# EAGLE design AntiAlias Filter_Diff_Active (EAGLE 9.5.2)

## Sheet 1 of 2
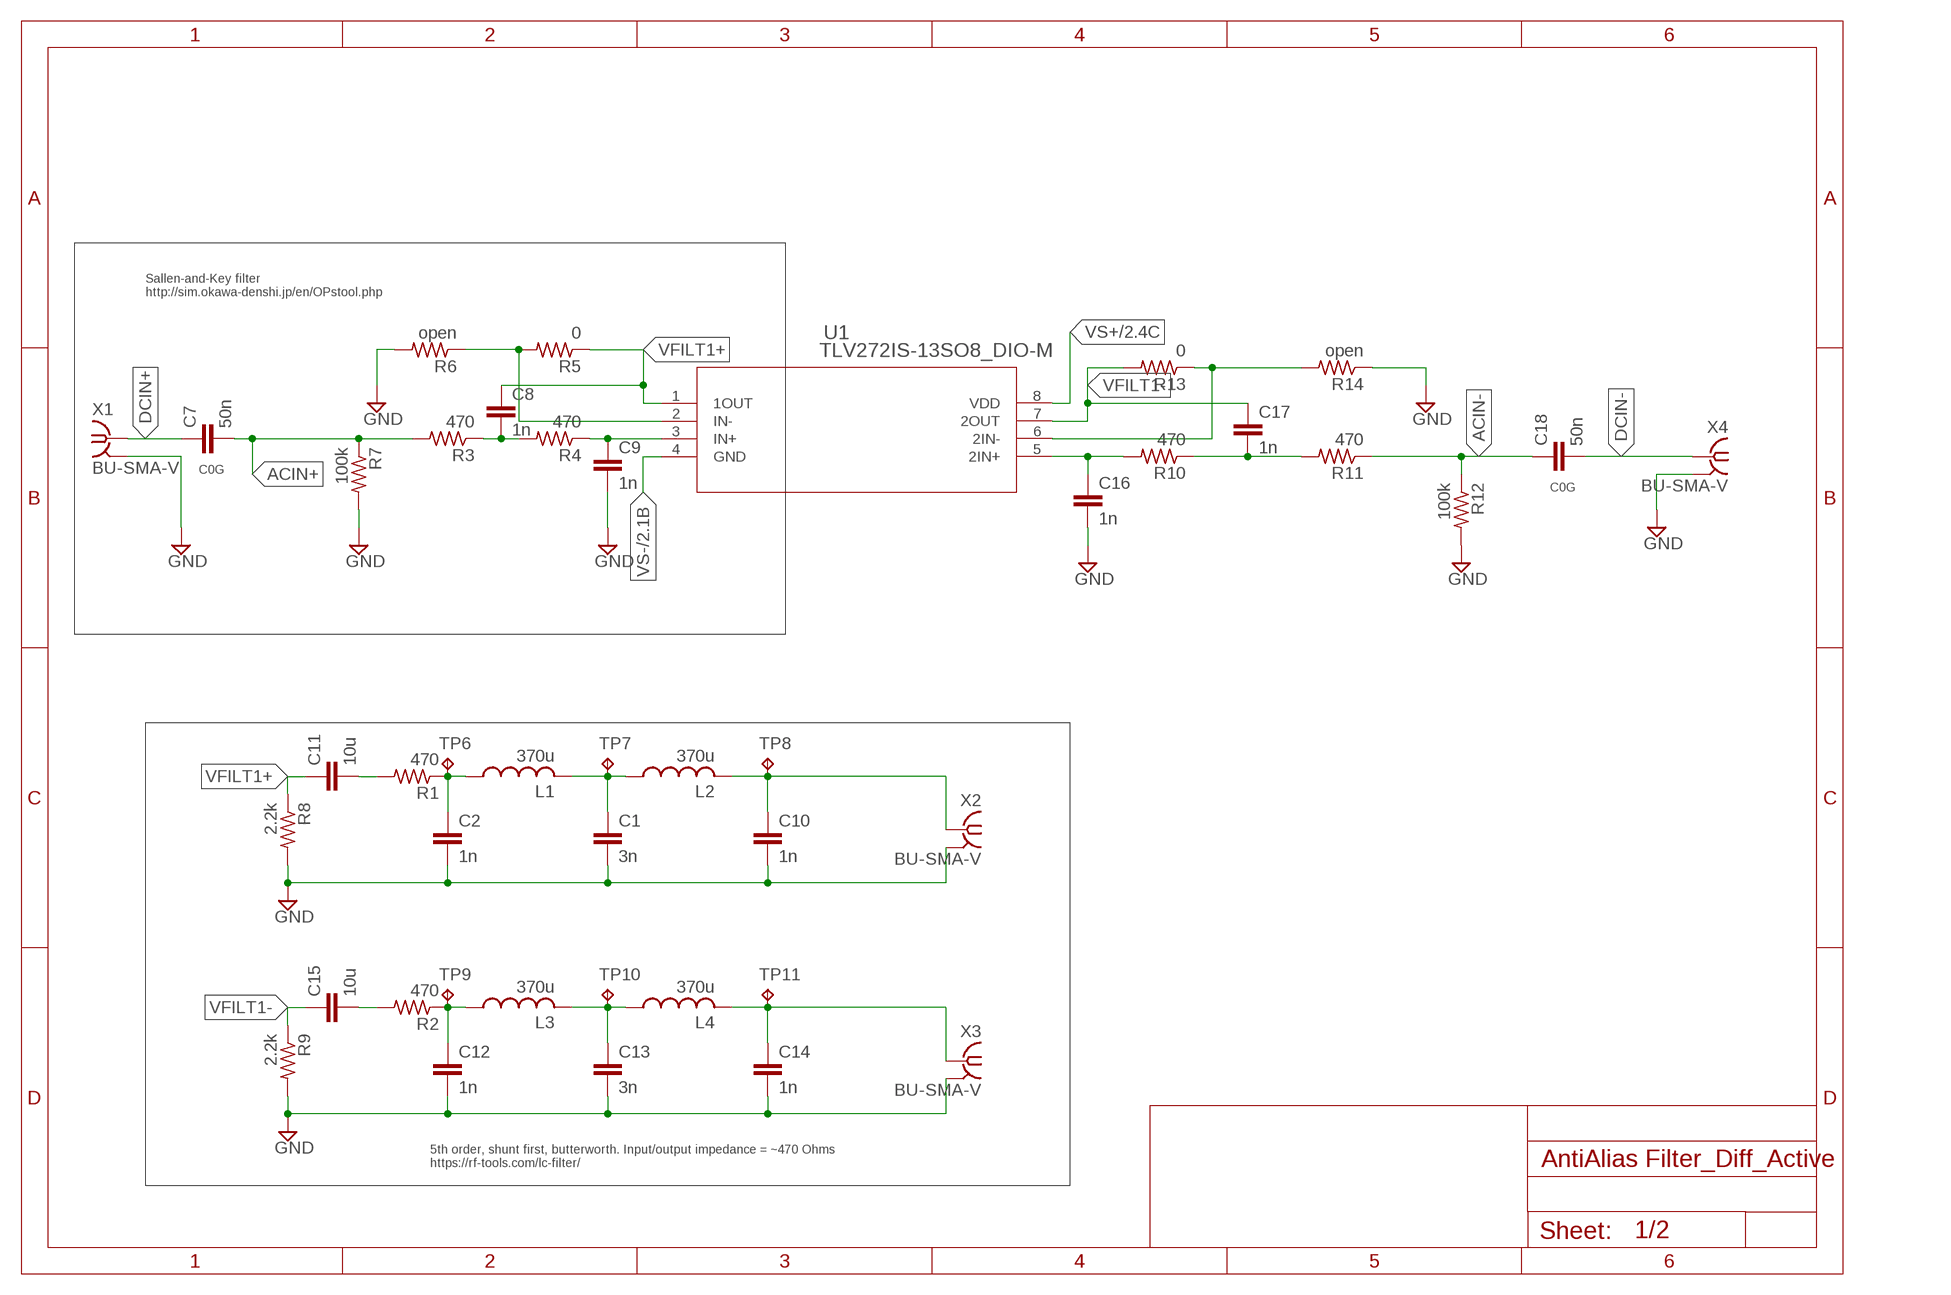
[diagram p0: schematic, sheet 1]

### Parts
C1  3n  C-EUC1206  [C1206]
C2  1n  C-EUC1206  [C1206]
C7  50n  C-EUC1210  [C1210]
C8  1n  C-EUC1206  [C1206]
C9  1n  C-EUC1206  [C1206]
C10  1n  C-EUC1206  [C1206]
C11  10u  C-EUC1210  [C1210]
C12  1n  C-EUC1206  [C1206]
C13  3n  C-EUC1206  [C1206]
C14  1n  C-EUC1206  [C1206]
C15  10u  C-EUC1210  [C1210]
C16  1n  C-EUC1206  [C1206]
C17  1n  C-EUC1206  [C1206]
C18  50n  C-EUC1210  [C1210]
L1  370u  L-USL1812  [L1812]
L2  370u  L-USL1812  [L1812]
L3  370u  L-USL1812  [L1812]
L4  370u  L-USL1812  [L1812]
R1  470  R-US_R1206  [R1206]
R2  470  R-US_R1206  [R1206]
R3  470  R-US_R1206  [R1206]
R4  470  R-US_R1206  [R1206]
R5  0  R-US_R1206  [R1206]
R6  open  R-US_R1206  [R1206]
R7  100k  R-US_R1206  [R1206]
R8  2.2k  R-US_R1206  [R1206]
R9  2.2k  R-US_R1206  [R1206]
R10  470  R-US_R1206  [R1206]
R11  470  R-US_R1206  [R1206]
R12  100k  R-US_R1206  [R1206]
R13  0  R-US_R1206  [R1206]
R14  open  R-US_R1206  [R1206]
TP6  TPTP20SQ  [TP20SQ]
TP7  TPTP20SQ  [TP20SQ]
TP8  TPTP20SQ  [TP20SQ]
TP9  TPTP20SQ  [TP20SQ]
TP10  TPTP20SQ  [TP20SQ]
TP11  TPTP20SQ  [TP20SQ]
U1  TLV272IS-13SO8_DIO-M  [SO8_DIO-M]
X1  BU-SMA-V  [BU-SMA-V]
X2  BU-SMA-V  [BU-SMA-V]
X3  BU-SMA-V  [BU-SMA-V]
X4  BU-SMA-V  [BU-SMA-V]

### Nets
ACIN+: C7.2 R3.2 R7.1
ACIN-: C18.1 R11.1 R12.1
DCIN+: C7.1 X1.1
DCIN-: C18.2 X4.1
GND [Power]: C1.2 C2.2 C9.2 C10.2 C12.2 C13.2 C14.2 C16.2 R6.2 R7.2 R8.2 R9.2 R12.2 R14.1 X1.2 X1.3 X1.4 X1.5 X2.2 X2.3 X2.4 X2.5 X3.2 X3.3 X3.4 X3.5 X4.2 X4.3 X4.4 X4.5 ; also sheet 2
N$1: C2.1 L1.1 R1.1 TP6.TP
N$2: C1.1 L1.2 L2.1 TP7.TP
N$3: C11.2 R1.2
N$4: C10.1 L2.2 TP8.TP X2.1
N$7: C14.1 L4.2 TP11.TP X3.1
N$8: C9.1 R4.1 U1.3(IN+)
N$9: C8.2 R3.1 R4.2
N$10: R5.2 R6.1 U1.2(IN-)
N$11: C12.1 L3.1 R2.1 TP9.TP
N$12: C13.1 L3.2 L4.1 TP10.TP
N$13: C15.2 R2.2
N$16: C17.2 R10.1 R11.2
N$17: C16.1 R10.2 U1.5(2IN+)
N$19: R13.1 R14.2 U1.6(2IN-)
VFILT1+: C8.1 C11.1 R5.1 R8.1 U1.1(1OUT)
VFILT1-: C15.1 C17.1 R9.1 R13.2 U1.7(2OUT)
VS+ [Power]: U1.8(VDD) ; also sheet 2
VS- [Power]: U1.4(GND) ; also sheet 2

### Notes on the sheet
- Sallen-and-Key filter
  http://sim.okawa-denshi.jp/en/OPstool.php
- C0G
- C0G
- 5th order, shunt first, butterworth. Input/output impedance = ~470 Ohms
  https://rf-tools.com/lc-filter/

## Sheet 2 of 2
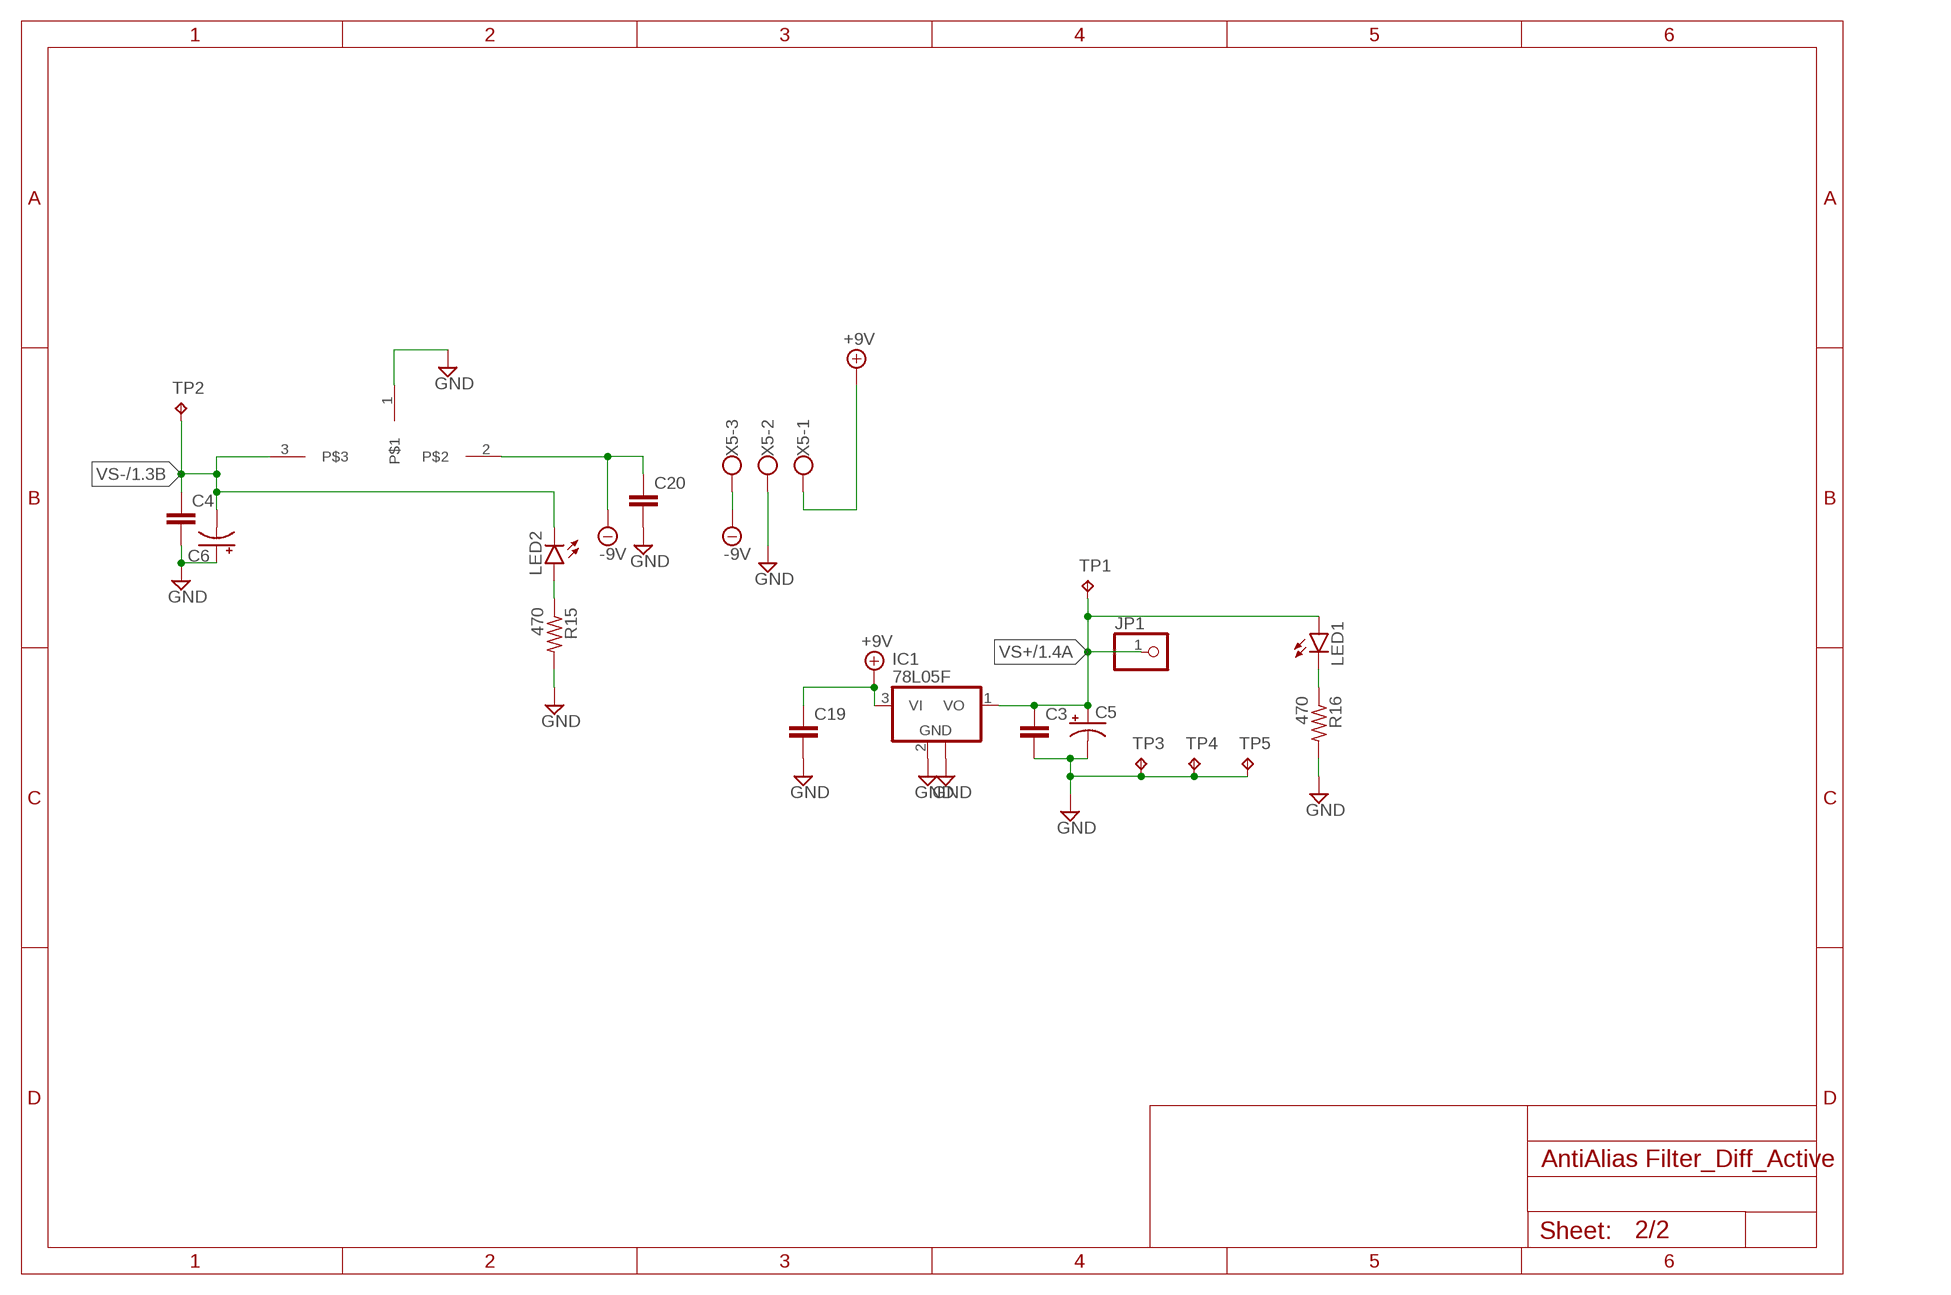
[diagram p1: schematic, sheet 2]

### Parts
C3  C-EUC1206  [C1206]
C4  C-EUC1206  [C1206]
C5  CPOL-USE2.5-5  [E2,5-5]
C6  CPOL-USE2.5-5  [E2,5-5]
C19  C-EUC1206  [C1206]
C20  C-EUC1206  [C1206]
IC1  78L05F  [SOT89]
JP1  PINHD-1X1  [1X01]
LED1  LEDCHIPLED_1206  [CHIPLED_1206]
LED2  LEDCHIPLED_1206  [CHIPLED_1206]
R15  470  R-US_R1206  [R1206]
R16  470  R-US_R1206  [R1206]
TP1  TPTP20SQ  [TP20SQ]
TP2  TPTP20SQ  [TP20SQ]
TP3  TPTP20SQ  [TP20SQ]
TP4  TPTP20SQ  [TP20SQ]
TP5  TPTP20SQ  [TP20SQ]
U$1  79LXX  [VREG_L78L12ABUTR]
X5  W237-103  [W237-103]

### Nets
+9V [Power]: C19.1 IC1.3(VI) X5.1
-9V [Power]: C20.1 U$1.2 X5.3
GND [Power]: C3.2 C4.2 C5.- C6.+ C19.2 C20.2 IC1.2(GND) IC1.2@1(GND) R15.2 R16.2 TP3.TP TP4.TP TP5.TP U$1.1 X5.2 ; also sheet 1
N$20: LED2.A R15.1
N$21: LED1.C R16.1
VS+ [Power]: C3.1 C5.+ IC1.1(VO) JP1.1 LED1.A TP1.TP ; also sheet 1
VS- [Power]: C4.1 C6.- LED2.C TP2.TP U$1.3 ; also sheet 1

## Library data of the parts
C1-C4 C7-C20 = Favorite_Parts:C-EU: CAPACITOR, European symbol; SPICEPREFIX: C
C5 C6 = Favorite_Parts:CPOL-US: POLARIZED CAPACITOR, American symbol; SPICEPREFIX: C
IC1 = linear:78L*: POSITOIV-VOLTAGE REGULATORS Output up to 100 mA Source: Datasheet <http://focus.ti.com/lit/ds/symlink/ua78l05.pdf>
JP1 = adafruit:PINHD-1X1: Pin header 1x1 for 0.1" spacing With round pins
L1-L4 = rcl:L-US: INDUCTOR, American symbol; SPICEPREFIX: L
LED1 LED2 = Favorite_Parts:LED: LED OSRAM: - CHIPLED LG R971, LG N971, LY N971, LG Q971, LY Q971, LO R971, LY R971 LH N974, LH R974 LS Q976, LO Q976, LY Q976 LO Q996 - Hyper CHIPLED LW Q18S LB Q993, LB Q99A, LB R99A - SideLED LS A670, LO A670, LY A670, LG A670, LP A670 LB A673, LV A673, LT A673, LW A673 LH A674 LY A675 LS A676, LA A676, LO A676, LY A676, LW A676 LS A679, LY A679, LG A679 - Hyper Micro SIDELED® LS Y876, LA Y876, LO Y876, LY Y876 LT Y87S - SmartLED LW L88C, LW L88S LB L89C, LB L89S, LG L890 LS L89K, LO L89K, LY L89K LS L896, LA L896, LO L896, LY L896 - TOPLED LS T670, LO T670, LY T670, LG T670, LP T670 LSG T670, LSP T670, LSY T670, LOP T670, LYG T670 LG T671, LOG T671, LSG T671 LB T673, LV T673, LT T673, LW T673 LH T674 LS T676, LA T676, LO T676, LY T676, LB T676, LH T676, LSB T676, LW T676 LB T67C, LV T67C, LT T67C, LS T67K, LO T67K, LY T67K, LW E67C LS E67B, LA E67B, LO E67B, LY E67B, LB E67C, LV E67C, LT E67C LW T67C LS T679, LY T679, LG T679 LS T770, LO T770, LY T770, LG T770, LP T770 LB T773, LV T773, LT T773, LW T773 LH T774 LS E675, LA E675, LY E675, LS T675 LS T776, LA T776, LO T776, LY T776, LB T776 LHGB T686 LT T68C, LB T68C - Hyper Mini TOPLED® LB M676 - Mini TOPLED Santana® LG M470 LS M47K, LO M47K, LY M47K Source: http://www.osram.convergy.de LUXEON: - LUMILED® LXK2-PW12-R00, LXK2-PW12-S00, LXK2-PW14-U00, LXK2-PW14-V00 LXK2-PM12-R00, LXK2-PM12-S00, LXK2-PM14-U00 LXK2-PE12-Q00, LXK2-PE12-R00, LXK2-PE12-S00, LXK2-PE14-T00, LXK2-PE14-U00 LXK2-PB12-K00, LXK2-PB12-L00, LXK2-PB12-M00, LXK2-PB14-N00, LXK2-PB14-P00, LXK2-PB14-Q00 LXK2-PR12-L00, LXK2-PR12-M00, LXK2-PR14-Q00, LXK2-PR14-R00 LXK2-PD12-Q00, LXK2-PD12-R00, LXK2-PD12-S00 LXK2-PH12-R00, LXK2-PH12-S00 LXK2-PL12-P00, LXK2-PL12-Q00, LXK2-PL12-R00 Source: www.luxeon.com KINGBRIGHT: KA-3528ASYC Source: www.kingbright.com
R1-R16 = Favorite_Parts:R-US_: RESISTOR, American symbol; SPICEPREFIX: R
TP1-TP11 = Favorite_Parts:TP: Test pad
U1 = MyParts:TLV272IS-13; BUILT_BY: EMA_UL_Team; MANUFACTURER_PART_NUMBER: TLV272IS-13; SOURCELIBRARY: DIODESINC_2_2015-08-18; VENDOR: Diodes Inc
U$1 = VREG_L78L12ABUTR:79LXX
X1-X4 = con-coax:BU-SMA-V: FEMALE SMA CONNECTOR Radiall distributor RS 112-3794; OC_FARNELL: unknown; OC_NEWARK: unknown
X5 = con-wago-500:W237-103: WAGO SCREW CLAMP; MPN: 237-103; OC_FARNELL: unknown; OC_NEWARK: 18M7116

## Net classes
1 Power: width 0.508 mm

## Board
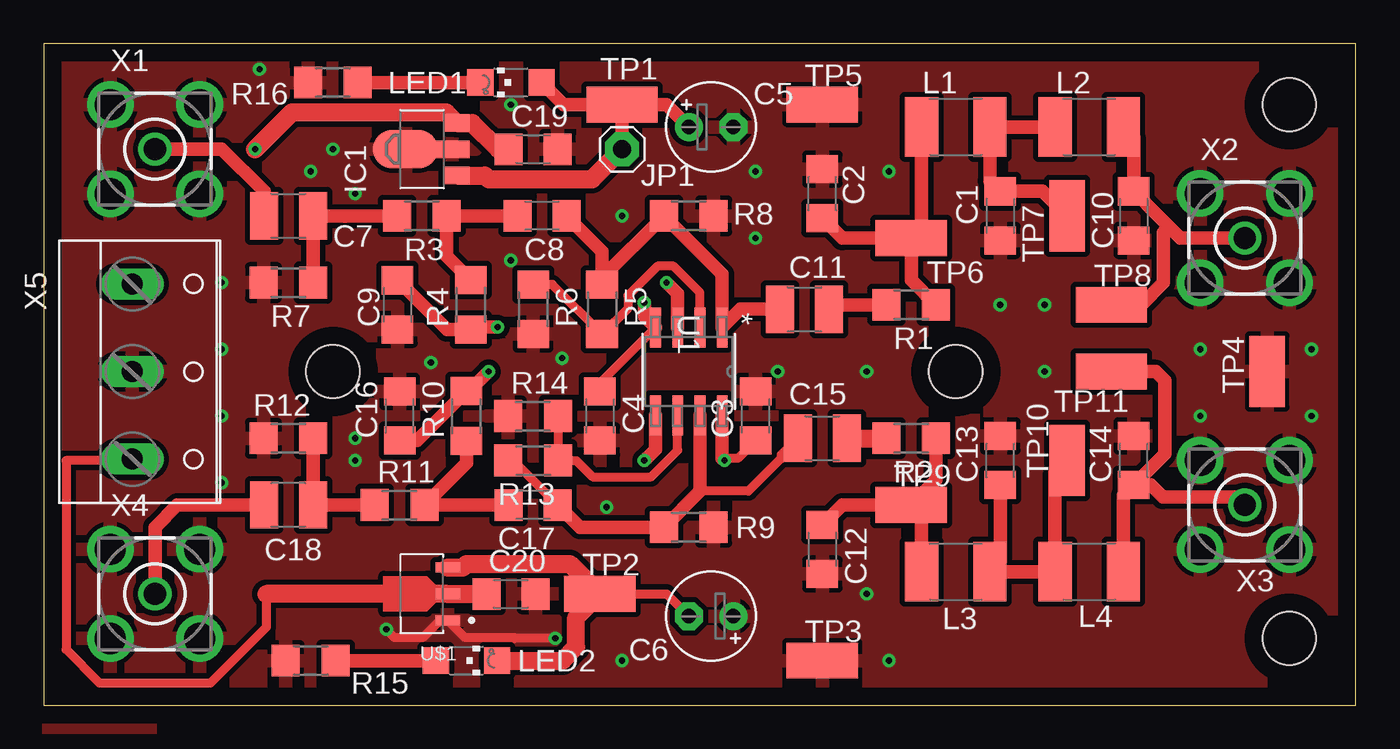
[diagram p2: board, top side]
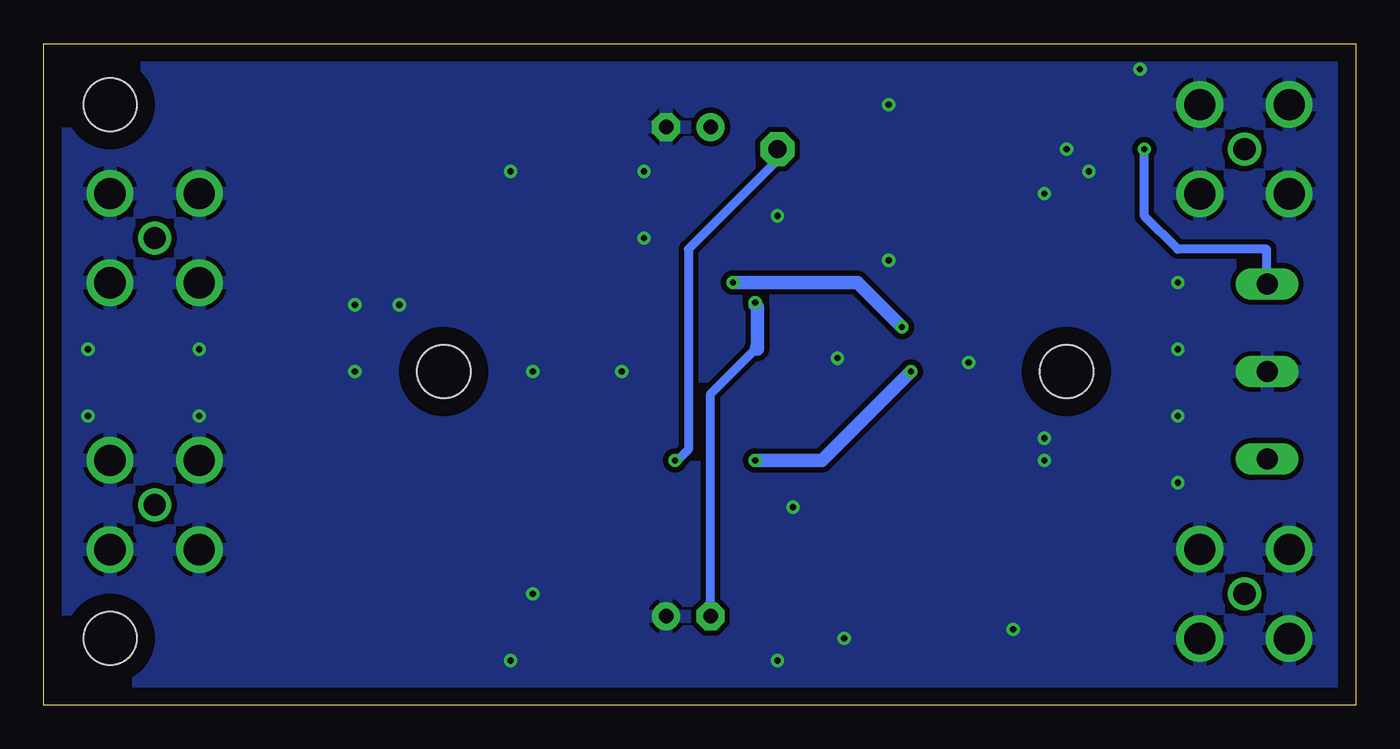
[diagram p3: board, bottom side, seen from below]

Size 74.91 x 37.77 mm. Coordinates in mm from the lower left corner, seen from the top.
Outline: 0,0 74.91,0 74.91,37.77 0,37.77 0,0
Copper layers (1*16): Top 0.035mm / dielectric 1.5mm / Bottom 0.035mm
Design rules "default *": minimum track width 6mil, minimum drill 0.35mm, track to track 12mil, track to pad 12mil, pad to pad 12mil, via to via 12mil, smd to smd 6mil, copper to edge 40mil, drill to drill 6mil, minimum pad ring 10mil, minimum via ring 8mil, stop-mask expansion 4mil, vias tented up to drill 0mil, thermal gap 10mil
Holes 3.05 mm at 16.51,19.05 52.07,19.05 71.12,34.29 71.12,3.81

### Footprints (pad centres in the part's own frame; a part is rotated, then mirrored left to right if it is on the bottom)
C1206 = smd 1.6 x 1.8: 1 -1.4,0; 2 1.4,0
E2,5-5 = drill 0.813 pad 1.6: + -1.27,0 | drill 0.813 pad 1.6 octagon: - 1.27,0
C1210 = smd 1.6 x 2.7: 1 -1.4,0; 2 1.4,0
SOT89 = smd 1 x 1.5: 1 -1.499,-1.981; 3 1.499,-1.981 | smd 1 x 2: 2 0,-1.727 | smd 2.2 x 3.7: 2@1 0,0.94
1X01 = drill 1.016 pad 1.93 octagon: 1 0,0
L1812 = smd 1.9 x 3.4: 1 -1.95,0; 2 1.95,0
CHIPLED_1206 = smd 1.5 x 1.5: A 0,-1.75; C 0,1.75
R1206 = smd 1.6 x 1.803: 1 -1.422,0; 2 1.422,0
TP20SQ = smd 4.064 x 2.032: TP 0,0
SO8_DIO-M = smd 2.286 x 0.61: 1 -2.515,1.905; 2 -2.515,0.635; 3 -2.515,-0.635; 4 -2.515,-1.905; 5 2.515,-1.905; 6 2.515,-0.635; 7 2.515,0.635; 8 2.515,1.905
VREG_L78L12ABUTR = smd 1.4 x 0.57: 1 -1.475,1.5; 3 -1.475,-1.5 | smd 1.4 x 0.65: 2 -1.475,0
BU-SMA-V = drill 1.27: 1 0,0 | drill 1.778: 2 -2.55,2.55; 3 2.55,2.55; 4 2.55,-2.55; 5 -2.55,-2.55
W237-103 = drill 1.194 long: 1 -5,-1.29; 2 0,-1.29; 3 5,-1.29

### Placement (x,y rotation side)
C1  54.61,27.94 270 top
C2  44.45,29.21 90 top
C3  40.64,16.51 90 top
C4  31.75,16.51 270 top
C5  38.1,33.02 0 top
C6  38.1,5.08 180 top
C7  13.97,27.94 0 top
C8  28.45,27.94 180 top
C9  20.19,22.86 270 top
C10  62.23,27.94 270 top
C11  43.43,22.61 0 top
C12  44.45,8.89 270 top
C13  54.61,13.97 90 top
C14  62.23,13.97 90 top
C15  44.45,15.24 0 top
C16  20.32,16.51 90 top
C17  27.94,11.43 180 top
C18  13.97,11.43 180 top
C19  27.94,31.75 0 top
C20  26.67,6.35 0 top
IC1  21.59,31.75 90 top
JP1  33.02,31.75 0 top
L1  52.07,33.02 0 top
L2  59.69,33.02 0 top
L3  52.07,7.62 0 top
L4  59.69,7.62 0 top
LED1  26.67,35.56 90 top
LED2  24.13,2.54 270 top
R1  49.53,22.86 180 top
R2  49.53,15.24 180 top
R3  21.59,27.94 180 top
R4  24.38,22.86 90 top
R5  31.88,22.61 270 top
R6  27.94,22.61 270 top
R7  13.97,24.13 180 top
R8  36.83,27.94 0 top
R9  36.83,10.16 0 top
R10  24.13,16.51 90 top
R11  20.32,11.43 0 top
R12  13.97,15.24 180 top
R13  27.94,13.97 180 top
R14  27.94,16.51 0 top
R15  15.24,2.54 180 top
R16  16.51,35.56 180 top
TP1  33.02,34.29 0 top
TP2  31.75,6.35 0 top
TP3  44.45,2.54 0 top
TP4  69.85,19.05 90 top
TP5  44.45,34.29 0 top
TP6  49.53,26.67 180 top
TP7  58.42,27.94 90 top
TP8  60.96,22.86 0 top
TP9  49.53,11.43 0 top
TP10  58.42,13.97 90 top
TP11  60.96,19.05 180 top
U1  36.83,19.05 270 top
U$1  21.59,6.35 180 top
X1  6.35,31.75 0 top
X2  68.58,26.67 0 top
X3  68.58,11.43 0 top
X4  6.35,6.35 0 top
X5  6.35,19.05 270 top

### Tracks (layer width: path | path; a pad name or v marks a point on that pad's centre or on a via)
+9V  (via drill 0.35)
  Top 1.016: C19.1 25.97,31.75 24.47,33.25 IC1.3 22.97,33.85 19.05,33.85 18.64,33.85 14.16,33.85 v12.06,31.75
  Bottom 0.508: v12.06,31.75 12.06,27.94 10.16,26.04 5.08,26.04 5.08,24.13 X5.1
-9V
  Top 0.508: 12.7,6.35 12.7,4.45 9.53,1.27 3.17,1.27 1.27,3.17 1.27,13.97 4.45,13.97 X5.3
  Top 1.016: 12.7,6.35 U$1.2 C20.1
  pour Top: 0,-1.27 5.08,-1.27 6.35,-1.27
ACIN+
  Top 0.762: R7.1 15.37,25.68 C7.2 R3.2
ACIN-
  Top 0.762: R12.1 15.37,13.69 C18.1 R11.1
DCIN+
  Top 0.762: X1.1 10.16,31.75 12.57,29.34 C7.1
DCIN-
  Top 0.762: X4.1 6.35,10.16 7.62,11.43 C18.2
GND  (via drill 0.35)
  Top 0.508: 27.94,20.95 R6.2 | v19.56,4.32 20.03,3.85 21.63,3.85 22.63,4.85 U$1.1 24.07,3.85 26.86,3.85 26.9,3.81 v29.21,3.81
  other vias: 10.16,24.13 10.16,20.32 10.16,16.51 10.16,12.7 22.1,19.56 29.59,19.81 41.91,19.05 46.99,19.05 54.61,22.86 57.15,19.05 57.15,22.86 66.04,20.32 72.39,20.32 72.39,16.51 66.04,16.51 46.99,6.35 40.64,26.67 40.64,30.48 48.26,30.48 16.51,31.75 32.13,11.3 33.02,2.54 48.26,2.54 12.32,36.32 26.67,34.29 26.67,25.4 33.02,27.94 15.24,30.48 17.78,29.21 17.78,13.97 17.78,15.24
  pour Top (rank 2): 0,38.1 0,-1.27 74.93,-1.27 74.93,38.1
  pour Bottom: 0,38.1 0,-1.27 74.93,-1.27 74.93,38.1
N$1
  Top 0.762: R1.1 49.53,24.28 TP6.TP | TP6.TP 45.59,26.67 C2.1 | L1.1 50.12,27.26 TP6.TP
N$2
  Top 0.762: L2.1 L1.2 54.02,29.93 C1.1 57.02,29.34 TP7.TP
N$3
  Top 0.762: C11.2 45.09,22.86 R1.2
N$4
  Top 0.762: L2.2 62.23,32.43 C10.1 63.63,27.94 64.27,27.3 | X2.1 64.9,26.67 64.27,27.3 | 64.27,27.3 63.94,26.98 63.94,24.13 62.66,22.86 TP8.TP
N$7
  Top 0.762: L4.2 61.64,11.98 C14.1 | C14.1 64.01,14.35 64.01,18.54 63.5,19.05 TP11.TP | C14.1 63.21,12.57 63.89,11.88 68.13,11.88 X3.1
N$8  (via drill 0.35)
  Top 0.762: C9.1 23.02,21.44 R4.1 24.54,21.59 v25.91,21.59 | v35.56,24.13 36.2,23.5 U1.3
  Bottom 0.762: v25.91,21.59 28.45,24.13 v35.56,24.13
N$9
  Top 0.762: R4.2 23.01,25.65 R3.1 C8.2
N$10
  Top 0.508: U1.2 37.47,23.55 35.95,25.07 35.04,25.07 33.35,23.38 33.35,22.66 R5.2 29.03,24.03 R6.1
N$11
  Top 0.762: C12.1 45.59,11.43 TP9.TP | TP9.TP 50.95,12.85 R2.1 | TP9.TP 50.12,10.84 L3.1
N$12
  Top 0.762: C13.1 54.61,8.21 L3.2 L4.1 57.74,13.29 TP10.TP
N$13
  Top 1.016: C15.2 R2.2
N$16
  Top 0.762: R10.1 24.13,13.82 R11.2 C17.2
N$17  (via drill 0.35)
  Top 0.762: C16.1 21.31,15.11 R10.2 24.28,17.93 v25.4,19.05 | U1.5 34.92,14.61 v34.29,13.97
  Bottom 0.762: v34.29,13.97 30.48,13.97 v25.4,19.05
N$19
  Top 0.508: R14.2 R13.1 30.4,13.97 31.34,13.03 34.68,13.03 36.2,14.55 U1.6
N$20
  Top 0.762: R15.1 LED2.A
N$21
  Top 0.762: R16.1 LED1.C
VFILT1+
  Top 0.762: C8.1 31.88,25.91 R5.1 31.88,24.41 R8.1 38.73,24.61 U1.1 39.78,22.61 C11.1
VFILT1-
  Top 0.508: R13.2 26.8,13.97 C17.1 | C15.1 42.1,14.29 42.1,14.08 40.24,12.22 37.47,12.22
  Top 0.762: C17.1 30.61,10.16 R9.1 37.47,12.22 U1.7
VS+  (via drill 0.35)
  Top 0.508: C3.1 39.63,14.1 38.73,14.1
  Top 0.762: 28.87,35.11 LED1.A 29.69,34.29 TP1.TP | TP1.TP JP1.1 | TP1.TP 35.56,34.29 C5.+ | U1.8 38.73,14.1 v38.86,13.97
  Top 1.016: IC1.1 25.19,30.25 25.4,30.04 31.31,30.04 JP1.1
  Bottom 0.508: JP1.1 33.02,31.11 38.1,26.04 38.1,14.61 38.73,13.97 v38.86,13.97
VS-  (via drill 0.35)
  Top 0.508: 26.04,2.54 LED2.C | C6.- 35.56,6.35 TP2.TP | U1.4 31.75,18.39 C4.1
  Top 0.762: U1.4 34.29,22.2 v34.29,22.99
  Top 1.016: U$1.3 23.92,7.85 24.13,8.06 30.04,8.06 TP2.TP 30.4,5 30.4,3.32 29.62,2.54 LED2.C
  Bottom 0.508: 34.23,20.39 36.83,17.78 C6.-
  Bottom 0.762: v34.29,22.99 34.29,22.86 34.16,22.73 34.16,20.32 34.23,20.39

### Text on the board
tDocu: In Ch1 | Out Ch1 | +9V | GND | -9V | Out Ch2 | In Ch2
bDocu: +9V | GND | -9V | Two-channel anti-aliasing filter / RC Sallen-Key filter + 5th order, Butterworth / 5 OCT 2020